# Altium schematic sheet Converters.SchDoc
size A4
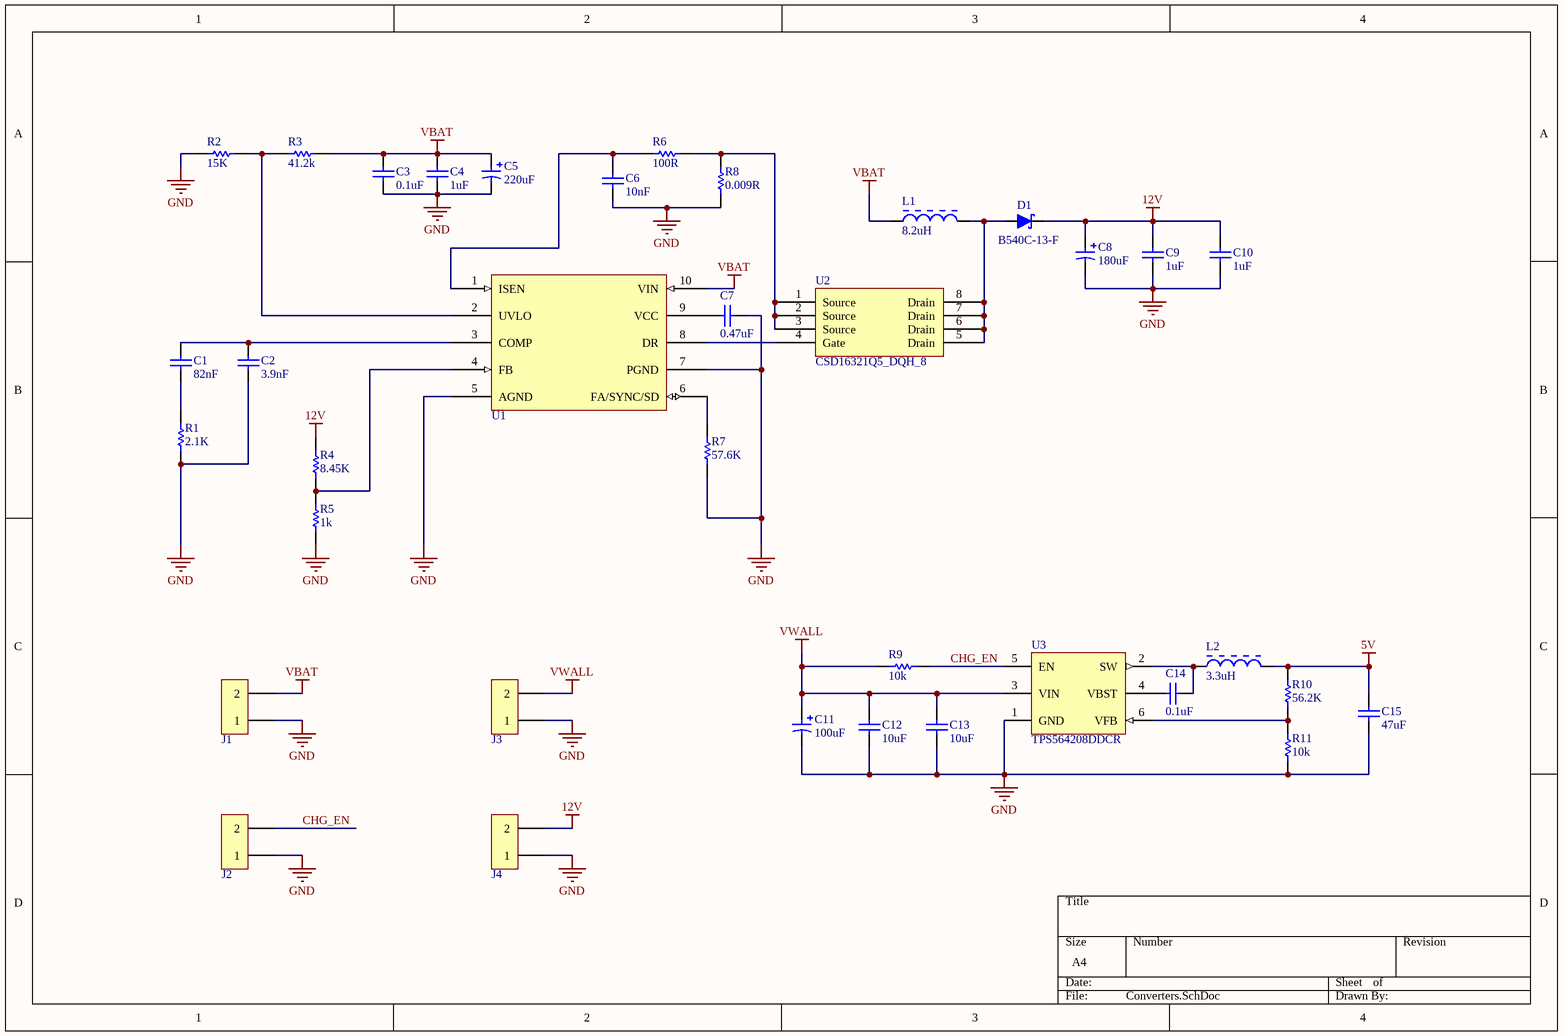
[diagram p0: Converters.SchDoc]

## Parts
C1  82nF  [CAPC1608X09N]
C2  3.9nF  [CAPC1608X09N]
C3  0.1uF  [CAPC1608X09N]
C4  1uF  [CAPC1608X09N]
C5  220uF  [UUD1V221MNL1GS]
C6  10nF  [CAPC1608X09N]
C7  0.47uF  [CAPC1608X09N]
C8  180uF  [PCAP_SVP_E12-M]
C9  1uF  [CAPC1608X09N]
C10  1uF  [CAPC1608X09N]
C11  100uF  [PCAP_8x10-ELEC00]
C12  10uF  [CAPC3216X18N]
C13  10uF  [CAPC3216X18N]
C14  0.1uF  [CAPC1608X09N]
C15  47uF  [CAPC3225X25M]
D1  B540C-13-F  [DIOM6959X25N]
J1  2POS THRU HOLE 2.54MM  [2POS Through Hole 2.54MM]  (value not drawn)
J2  2POS THRU HOLE 2.54MM  [2POS Through Hole 2.54MM]  (value not drawn)
J3  2POS THRU HOLE 2.54MM  [2POS Through Hole 2.54MM]  (value not drawn)
J4  2POS THRU HOLE 2.54MM  [2POS Through Hole 2.54MM]  (value not drawn)
L1  8.2uH  [SRP1270]
L2  3.3uH  [IND_BOURNS_SRP00]
R1  2.1K  [RESC1608X06N]
R2  15K  [RESC1608X06N]
R3  41.2k  [RESC1608X06N]
R4  8.45K  [RESC1608X06N]
R5  1k  [RESC1608X06N]
R6  100R  [RESC1608X06N]
R7  57.6K  [RESC1608X06N]
R8  0.009R  [RESC3216X07N]
R9  10k  [RESC1608X06N]
R10  56.2K  [RESC1608X06N]
R11  10k  [RESC1608X06N]
U1  LM3481  [VSSOP10]  (value not drawn)
U2  CSD16321Q5_DQH_8  [DQH8]
U3  TPS564208DDCR  [SOT95P280X110-6N (DDC)]

## Nets
5V: C15.2 L2.2 R10.2
12V: C8.1 C9.2 C10.2 D1.2 J4.2 R4.1
GND: C2.1 C3.1 C4.1 C5.2 C6.1 C7.2 C8.2 C9.1 C10.1 C11.2 C12.1 C13.1 C15.1 J1.1 J2.1 J3.1 J4.1 R1.1 R2.1 R5.1 R7.1 R8.1 R11.1 U1.5(AGND) U1.7(PGND) U3.1(GND)
VBAT: C3.2 C4.2 C5.1 J1.2 L1.1 R3.2 U1.10(VIN)
VWALL: C11.1 C12.2 C13.2 J3.2 R9.1 U3.3(VIN)
CHG_EN: J2.2 R9.2 U3.5(EN)
NetC1_1: C1.1 R1.2
NetC1_2: C1.2 C2.2 U1.3(COMP)
NetC6_2: C6.2 R6.1 U1.1(ISEN)
NetC7_1: C7.1 U1.9(VCC)
NetC14_1: C14.1 U3.4(VBST)
NetC14_2: C14.2 L2.1 U3.2(SW)
NetD1_1: D1.1 L1.2 U2.5(Drain) U2.6(Drain) U2.7(Drain) U2.8(Drain)
NetR2_2: R2.2 R3.1 U1.2(UVLO)
NetR4_2: R4.2 R5.2 U1.4(FB)
NetR6_2: R6.2 R8.2 U2.1(Source) U2.2(Source) U2.3(Source)
NetR7_2: R7.2 U1.6(FA/SYNC/SD)
NetR10_1: R10.1 R11.2 U3.6(VFB)
NetU1_8: U1.8(DR) U2.4(Gate)

## Library data of the parts
C1 = CAP CER 82nF 0603: Manufacturer: Murata; Voltage: 25V; Rating: X7R; Tolerance: 10%; Value: 82nF; Digikey Part Number: 490-6434-1-ND; Package: 0603
C2 = CAP CER 3.9nF 0603: Manufacturer: Murata; Rating: X7R; Voltage: 25V; Tolerance: 10%; Value: 3.9nF; Digikey Part Number: 490-11525-1-ND
C3 C14 = CAP CER 0.1uF 0603: Voltage: 50V; Rating: X7R; Tolerance: 10%; Value: 0.1uF; Digikey Part Number: 490-1519-1-ND; Package: 0603
C4 C9 C10 = CAP CER 1uF 0603: Voltage: 35V; Value: 1uF; Digikey Part Number: 490-10487-1-ND
C5 = CAP ALUM 220uF SMD: Manufacturer: Nichicon; Voltage: 35V; Digikey Part Number: 493-2292-1-ND; Value: 220uF
C6 = CAP CER 10nF 0603: Bypass caps; Manufacturer: Murata; Value: 10nF; Digikey Part Number: 490-9666-1-ND
C7 = CAP CER 0.47uF 0603: Voltage: 25V; Rating: X7R; Value: 0.47uF; Digikey Part Number: 490-3291-1-ND
C8 = CAP ALUM 180uF SMD: Manufacturer: Panasonic; Voltage: 25V; Digikey Part Number: P16510CT-ND; Value: 180uF
C11 = CAP ALUM 100uF SMD: Manufacturer: Nichicon; Voltage: 50V; Digikey Part Number: 493-2226-1-ND; Value: 100uF
C12 C13 = CAP CER 10uF 1206: 3V3 filter cap; Voltage: 25V; Rating: X7R; Digikey Part Number: 490-6518-1-ND; Value: 10uF
C15 = CAP CER 47uF X5R 1210: Manufacturer: Murata; Manufacturer Part Number: GRM32ER61C476KE15K; Voltage: 16V; Rating: X5R; Tolerance: 10%; Value: 47uF; Digikey Part Number: 490-6538-1-ND; Package: 1210
D1 = B540C-13-F: Diode Schottky 40V 5A SMT; Type: SCHOTTKY; Footprint: DO-214AB, SMC; Voltage: 40V; Current: 5A; Digikey Part Number: B540C-FDICT-ND; Value: B540C-13-F
L1 = IND 8.2uH 11A SMD NONSTANDARD: Digikey Part Number: SRP1270-8R2MCT-ND; Value: 8.2uH
L2 = IND 3.3µH 7A SMD: Digikey Part Number: SRP7030-3R3FMCT-ND; Value: 3.3uH
R1 = RES 2.1K 0603: Manufacturer: Yageo; Tolerance: 1%; Power: 0.1W; Type: RES; Footprint: 0603; Digikey Part Number: 311-2.10KHRCT-ND; Value: 2.1K
R2 = RES 15K 0603: Tolerance: 1%; Type: RES; Footprint: 0603; Value: 15K; Digikey Part Number: 311-15.0KHRCT-ND
R3 = RES 41.2K 0603: Manufacturer: Vishay Dale; Tolerance: 1%; Power: 0.1W; Type: RES; Footprint: 0603; Digikey Part Number: 311-41.2KHRCT-ND; Value: 41.2k
R4 = RES 8.45K 0603: Manufacturer: Vishay Dale; Tolerance: 1%; Power: 0.1W; Type: RES; Footprint: 0603; Digikey Part Number: 541-8.45KHCT-ND; Value: 8.45K
R5 = RES 1K 0603: Manufacturer: Panasonic; Manufacturer Part Number: ERJ-PA3F1001V; Tolerance: 1%; Power: 0.25W; Type: RES; Footprint: 0603; Temperature: 155dC; Digikey Part Number: P1.0KBYCT-ND; Value: 1k
R6 = RES 100R 0603: Tolerance: 1%; Power: 0.25W; Type: RES; Footprint: 0603; Digikey Part Number: 541-100SACT-ND; Value: 100R
R7 = RES 57.6K 0603: Manufacturer: Yageo; Manufacturer Part Number: RC0603FR-0757K6L; Tolerance: 1%; Power: 0.1W; Type: RES; Footprint: 0603; Digikey Part Number: 311-57.6KHRCT-ND; Value: 57.6K; Temperature: 155dC
R8 = RES 0.009R 1206: Manufacturer: Rohm Semiconductor; Tolerance: 1%; Power: 1W; Type: RES; Footprint: 1206; Digikey Part Number: RHM.009ALCT-ND; Value: 0.009R
R9 R11 = RES 10K 0603: Manufacturer: Yageo; Manufacturer Part Number: RC0603FR-0710KL; Tolerance: 1%; Power: 0.1W; Type: RES; Footprint: 0603; Temperature: 155dC; Digikey Part Number: 311-10.0KHRCT-ND; Value: 10k
R10 = RES 56.2K 0603: Manufacturer: Yageo; Manufacturer Part Number: RC0603FR-0756K2L; Tolerance: 1%; Power: 0.1W; Type: RES; Footprint: 0603; Temperature: 155dC; Digikey Part Number: 311-56.2KHRCT-ND; Value: 56.2K
U1 = LM3481: IC REG CTRLR MULT TOP 10MSOP; Digikey Part Number: LM3481MM/NOPBCT-ND
U2 = CSD16321Q5_DQH_8: Manufacturer: Texas Instruments; INDUSTRY_STD_PKG_TYPE: SON; FAMILY_NAME: N-Channel MOSFET Transistors; PIN_COUNT: 8; PACKAGE_DESIGNATOR: DQH; Datasheet URL: http://www.ti.com/lit/gpn/CSD16321Q5; GENERIC_PART_NUMBER: CSD16321Q5; RefDes: RefDes; Type: DEV; Value: Value; Digikey Part Number: 296-25643-1-ND
U3 = TPS564208DDCR: Regulator, Buck, 4.5V-17V Input, SOT-23; Manufacturer: Texas Instruments; Value: TPS564208DDCR; Digikey Part Number: 296-44123-1-ND